# EAGLE design light (EAGLE 7.2.0)
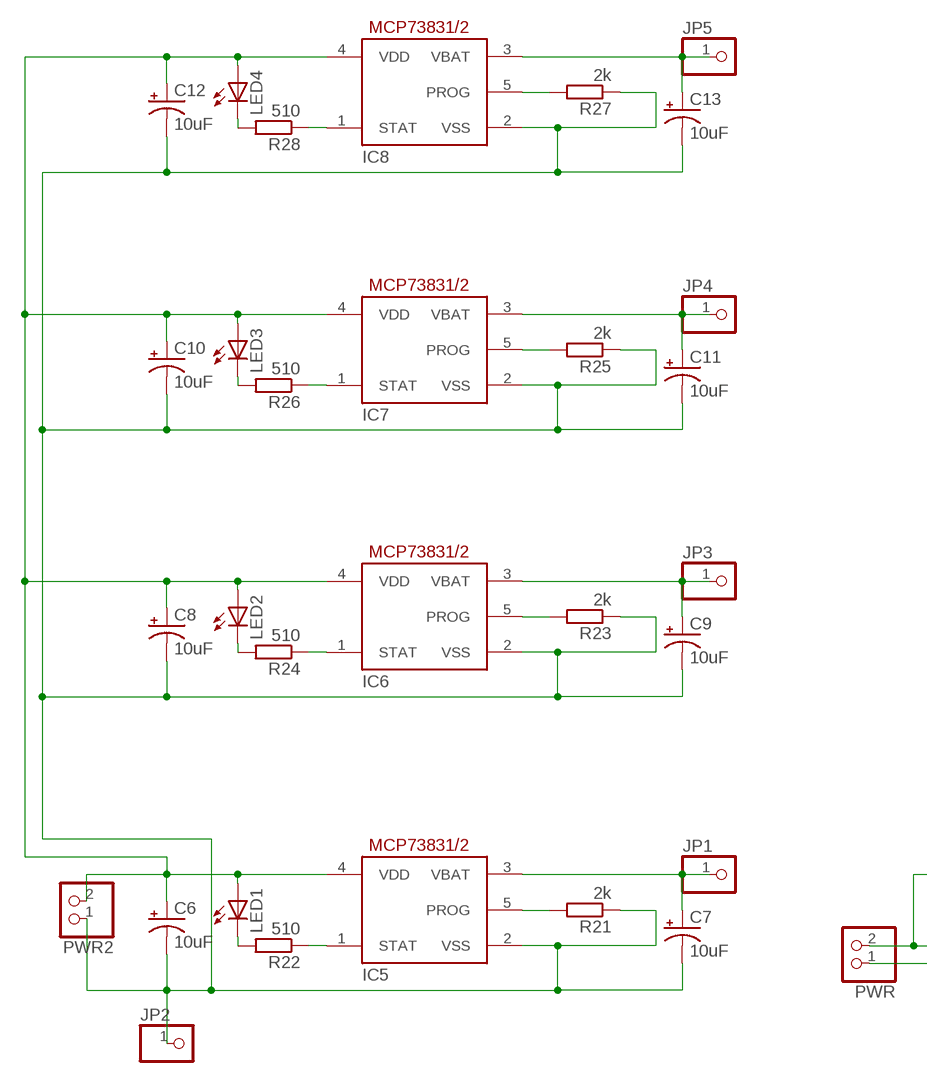
[diagram p0: schematic, sheet 1, part 1 of 2]
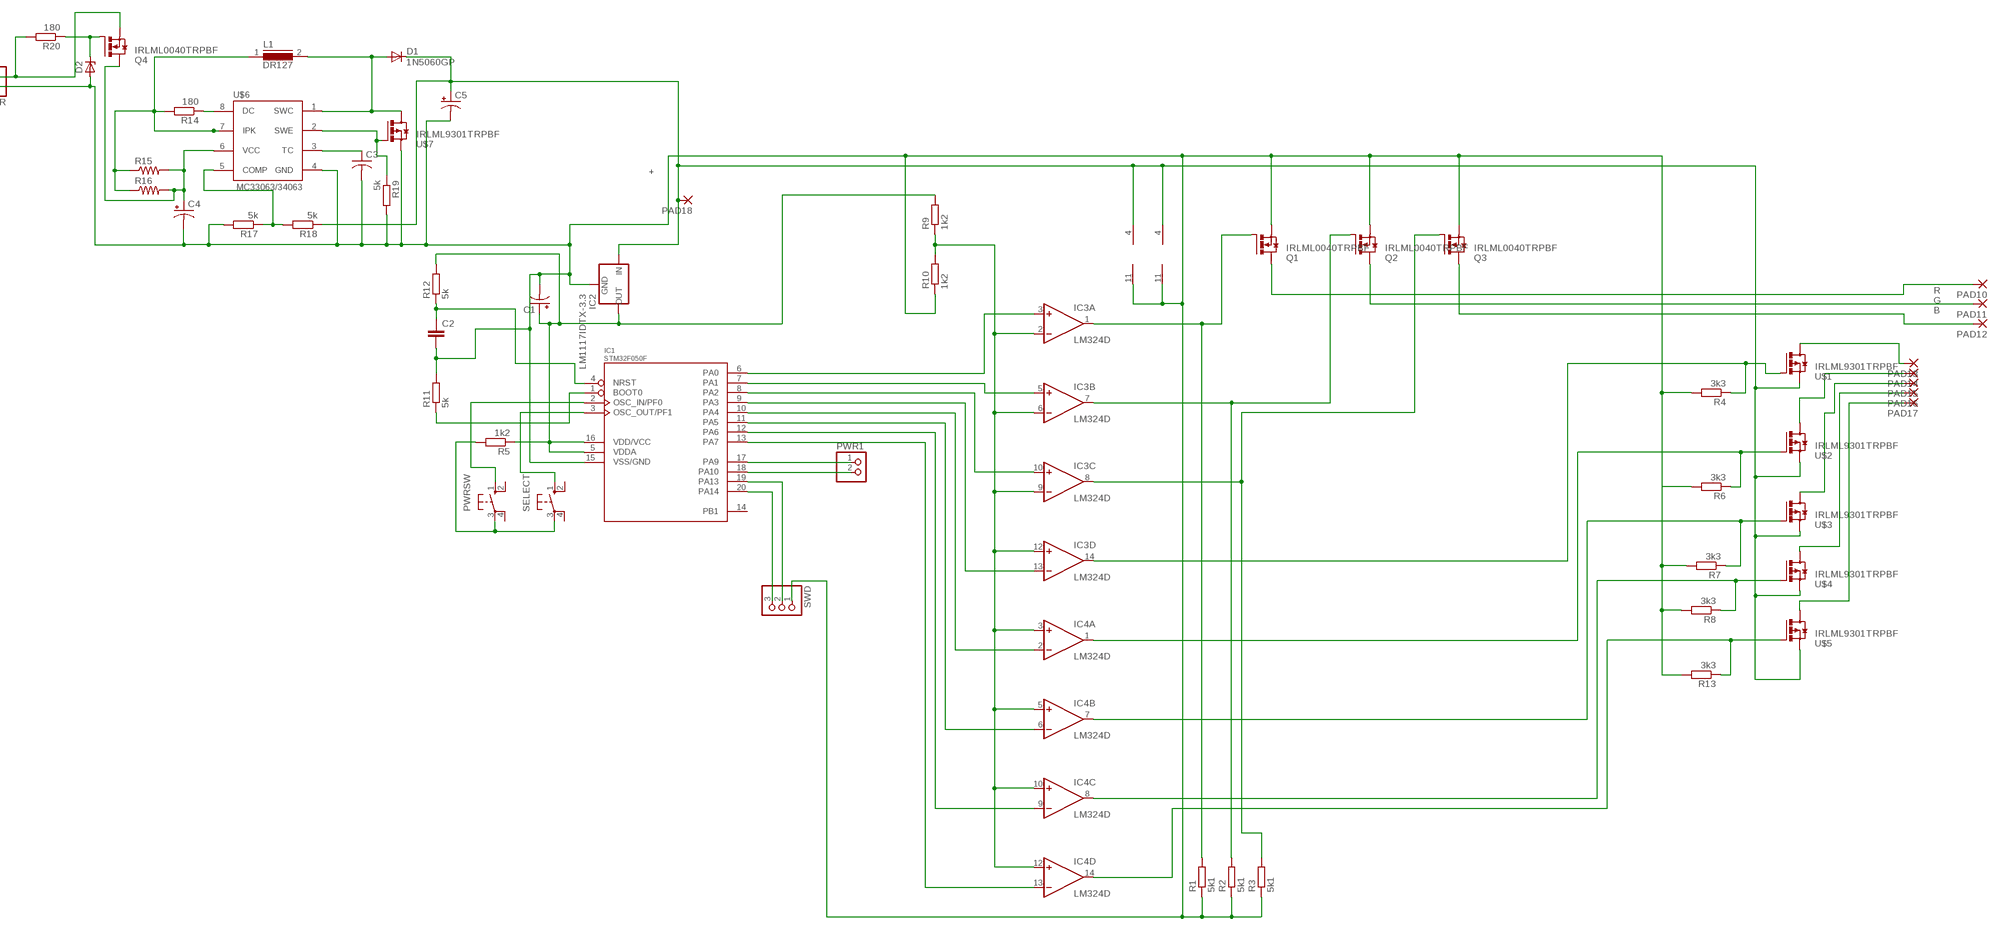
[diagram p1: schematic, sheet 1, part 2 of 2]

## Parts
C1  CPOL-USSMCD  [SMC_D]
C2  C-EUC1206  [C1206]
C3  C-US050-024X044  [C050-024X044]
C4  CPOL-USE5-8.5  [E5-8,5]
C5  CPOL-USE5-8.5  [E5-8,5]
C6  10uF  CPOL-USSMCD  [SMC_D]
C7  10uF  CPOL-USSMCD  [SMC_D]
C8  10uF  CPOL-USSMCD  [SMC_D]
C9  10uF  CPOL-USSMCD  [SMC_D]
C10  10uF  CPOL-USSMCD  [SMC_D]
C11  10uF  CPOL-USSMCD  [SMC_D]
C12  10uF  CPOL-USSMCD  [SMC_D]
C13  10uF  CPOL-USSMCD  [SMC_D]
D1  1N5060GP  [DO15-12]
D2  ZENER-DIODESOD80C  [SOD80C]
IC1  STM32F050F  [TSSOP20]
IC2  LM1117IDTX-3.3  [TO252]
IC3  LM324D  [SO14]
IC4  LM324D  [SO14]
IC5  MCP73831/OT  [SOT23-5L]
IC6  MCP73831/OT  [SOT23-5L]
IC7  MCP73831/OT  [SOT23-5L]
IC8  MCP73831/OT  [SOT23-5L]
JP1  PINHD-1X1  [1X01]
JP2  PINHD-1X1  [1X01]
JP3  PINHD-1X1  [1X01]
JP4  PINHD-1X1  [1X01]
JP5  PINHD-1X1  [1X01]
L1  DR127  [DR127]
LED1  LED  [SMARTLED-TTW]
LED2  LED  [SMARTLED-TTW]
LED3  LED  [SMARTLED-TTW]
LED4  LED  [SMARTLED-TTW]
PAD10  SMD2  [SMD1,27-2,54]
PAD11  SMD2  [SMD1,27-2,54]
PAD12  SMD2  [SMD1,27-2,54]
PAD13  SMD2  [SMD1,27-2,54]
PAD14  SMD2  [SMD1,27-2,54]
PAD15  SMD2  [SMD1,27-2,54]
PAD16  SMD2  [SMD1,27-2,54]
PAD17  SMD2  [SMD1,27-2,54]
PAD18  SMD2  [SMD1,27-2,54]
PWR  PINHD-1X2  [1X02]
PWR1  PINHD-1X2  [1X02]
PWR2  PINHD-1X2  [1X02]
PWRSW  10-XX  [B3F-10XX]
Q1  IRLML0040TRPBF  [MICRO3]
Q2  IRLML0040TRPBF  [MICRO3]
Q3  IRLML0040TRPBF  [MICRO3]
Q4  IRLML0040TRPBF  [MICRO3]
R1  5k1  R-EU_M1206  [M1206]
R2  5k1  R-EU_M1206  [M1206]
R3  5k1  R-EU_M1206  [M1206]
R4  3k3  R-EU_M1206  [M1206]
R5  1k2  R-EU_M1206  [M1206]
R6  3k3  R-EU_M1206  [M1206]
R7  3k3  R-EU_M1206  [M1206]
R8  3k3  R-EU_M1206  [M1206]
R9  1k2  R-EU_M1206  [M1206]
R10  1k2  R-EU_M1206  [M1206]
R11  5k  R-EU_M1206  [M1206]
R12  5k  R-EU_M1206  [M1206]
R13  3k3  R-EU_M1206  [M1206]
R14  180  R-EU_M1206  [M1206]
R15  R-US_0207/12  [0207/12]
R16  R-US_0207/12  [0207/12]
R17  5k  R-EU_M1206  [M1206]
R18  5k  R-EU_M1206  [M1206]
R19  5k  R-EU_M1206  [M1206]
R20  180  R-EU_M1206  [M1206]
R21  2k  R-EU_M1206  [M1206]
R22  510  R-EU_M1206  [M1206]
R23  2k  R-EU_M1206  [M1206]
R24  510  R-EU_M1206  [M1206]
R25  2k  R-EU_M1206  [M1206]
R26  510  R-EU_M1206  [M1206]
R27  2k  R-EU_M1206  [M1206]
R28  510  R-EU_M1206  [M1206]
SELECT  10-XX  [B3F-10XX]
SWD  PINHD-1X3  [1X03]
U$1  IRLML9301TRPBF  [MICRO3]
U$2  IRLML9301TRPBF  [MICRO3]
U$3  IRLML9301TRPBF  [MICRO3]
U$4  IRLML9301TRPBF  [MICRO3]
U$5  IRLML9301TRPBF  [MICRO3]
U$6  MC33063/MC34063D  [SO08]
U$7  IRLML9301TRPBF  [MICRO3]

## Nets
N$1: IC3.8(C:OUT) Q3.1(G) R3.2
N$2: IC3.7(B:OUT) Q2.1(G) R2.2
N$3: IC3.14(D:OUT) R4.1 U$1.1(G)
N$4: IC4.1(A:OUT) R6.1 U$2.1(G)
N$5: PWR.2 Q4.2(S) R20.2
N$6: PWRSW.3(P) R5.2 SELECT.3(P)
N$7: PAD10.1(P) Q1.3(D)
N$8: PAD11.1(P) Q2.3(D)
N$9: PAD12.1(P) Q3.3(D)
N$10: IC4.7(B:OUT) R7.1 U$3.1(G)
N$11: IC4.8(C:OUT) R8.1 U$4.1(G)
N$12: IC4.14(D:OUT) R13.1 U$5.1(G)
N$13: IC1.6(PA0) IC3.3(A:+IN)
N$14: IC1.7(PA1) IC3.5(B:+IN)
N$15: IC1.8(PA2) IC3.10(C:+IN)
N$16: IC1.9(PA3) IC3.13(D:-IN)
N$17: IC1.10(PA4) IC4.2(A:-IN)
N$18: IC1.11(PA5) IC4.6(B:-IN)
N$19: IC1.12(PA6) IC4.9(C:-IN)
N$20: IC1.13(PA7) IC4.13(D:-IN)
N$21: PAD13.1(P) U$1.3(D)
N$22: PAD14.1(P) U$2.3(D)
N$23: PAD15.1(P) U$3.3(D)
N$24: IC3.2(A:-IN) IC3.6(B:-IN) IC3.9(C:-IN) IC3.12(D:+IN) IC4.3(A:+IN) IC4.5(B:+IN) IC4.10(C:+IN) IC4.12(D:+IN) R9.1 R10.2
N$25: PAD16.1(P) U$4.3(D)
N$26: PAD17.1(P) U$5.3(D)
N$27: IC1.17(PA9) PWR1.1
N$28: IC1.18(PA10) PWR1.2
N$30: L1.1 R14.2 R15.1 R16.1 U$6.7(IPK)
N$31: C2.1 IC1.4(NRST) R12.1
N$32: IC1.1(BOOT0) R11.1
N$33: D1.A L1.2 U$6.1(SWC) U$7.3(D)
N$34: IC1.19(PA13) SWD.2
N$35: IC1.20(PA14) SWD.3
N$36: R14.1 U$6.8(DC)
N$37: IC1.2(OSC_IN/PF0) PWRSW.1(S)
N$38: C4.+ Q4.3(D) R15.2 R16.2 U$6.6(VCC)
N$39: IC3.1(A:OUT) Q1.1(G) R1.2
N$40: C1.+ IC1.5(VDDA) IC1.16(VDD/VCC) IC2.TAB(OUT) R5.1 R9.2 R12.2
N$41: C1.- C2.2 C3.2 C4.- C5.- D2.A IC1.15(VSS/GND) IC2.1(GND) IC3.11(P:V-) IC4.11(P:V-) PWR.1 Q1.2(S) Q2.2(S) Q3.2(S) R1.1 R2.1 R3.1 R4.2 R6.2 R7.2 R8.2 R10.1 R11.2 R13.2 R17.2 R19.2 SWD.1 U$6.4(GND) U$7.2(S)
N$42: C3.1 U$6.3(TC)
N$43: C5.+ D1.C IC2.2(IN) IC3.4(P:V+) IC4.4(P:V+) PAD18.1(P) R18.1 U$1.2(S) U$2.2(S) U$3.2(S) U$4.2(S) U$5.2(S)
N$44: D2.C Q4.1(G) R20.1
N$45: IC5.5(PROG) R21.2
N$46: IC1.3(OSC_OUT/PF1) SELECT.1(S)
N$47: R17.1 R18.2 U$6.5(COMP)
N$49: R19.1 U$6.2(SWE) U$7.1(G)
N$50: IC5.1(STAT) R22.1
N$52: LED1.C@1(C) R22.2
N$53: IC6.5(PROG) R23.2
N$54: C7.+ IC5.3(VBAT) JP1.1
N$55: C6.- C7.- C8.- C9.- C10.- C11.- C12.- C13.- IC5.2(VSS) IC6.2(VSS) IC7.2(VSS) IC8.2(VSS) JP2.1 PWR2.1 R21.1 R23.1 R25.1 R27.1
N$56: IC6.1(STAT) R24.1
N$57: C6.+ C8.+ C10.+ C12.+ IC5.4(VDD) IC6.4(VDD) IC7.4(VDD) IC8.4(VDD) LED1.A@1(A) LED2.A@1(A) LED3.A@1(A) LED4.A@1(A) PWR2.2
N$58: LED2.C@1(C) R24.2
N$59: C9.+ IC6.3(VBAT) JP3.1
N$60: IC7.5(PROG) R25.2
N$62: IC7.1(STAT) R26.1
N$64: LED3.C@1(C) R26.2
N$65: C11.+ IC7.3(VBAT) JP4.1
N$66: IC8.5(PROG) R27.2
N$68: IC8.1(STAT) R28.1
N$70: LED4.C@1(C) R28.2
N$71: C13.+ IC8.3(VBAT) JP5.1
Unconnected: IC1.14(PB1) PWRSW.2(S1) PWRSW.4(P1) SELECT.2(S1) SELECT.4(P1)

## Notes on the sheet
- +
- R
- G
- B

## Library data of the parts
C1 C6-C13 = rcl:CPOL-US: POLARIZED CAPACITOR, American symbol
C2 = rcl:C-EU: CAPACITOR, European symbol
C3 = adafruit:C-US: CAPACITOR, American symbol
C4 C5 = adafruit:CPOL-US: POLARIZED CAPACITOR, American symbol
D1 = diode:1N5060GP: DIODE controlled avalanche rectifier
D2 = diode:ZENER-DIODE: Z-Diode
IC1 = STM32F050:STM32F050*: STM32F050xxF*
IC2 = lm1117:LM1117IDTX-*
IC3 IC4 = linear:LM324: OP AMP
IC5-IC8 = adafruit:MCP73831: MCP73831/2 Miniature Single-Cell, Fully Integrated Li-Ion, Li-Polymer Charge Management Controllers. Nice and small simple lipoly charge controller, with adjustable current and status output (LED) http://www.ladyada.net/library/pcb/eaglelibrary.html
JP1-JP5 = adafruit:PINHD-1X1: Pin header 1x1 for 0.1" spacing With round pins
L1 = inductors:DR127: High Power Density, High Efficiency, Shielded Inductors Source: coiltronics_dr_series.pdf
LED1-LED4 = adafruit:LED: LED OSRAM: - CHIPLED LG R971, LG N971, LY N971, LG Q971, LY Q971, LO R971, LY R971 LH N974, LH R974 LS Q976, LO Q976, LY Q976 LO Q996 - Hyper CHIPLED LW Q18S LB Q993, LB Q99A, LB R99A - SideLED LS A670, LO A670, LY A670, LG A670, LP A670 LB A673, LV A673, LT A673, LW A673 LH A674 LY A675 LS A676, LA A676, LO A676, LY A676, LW A676 LS A679, LY A679, LG A679 - Hyper Micro SIDELED® LS Y876, LA Y876, LO Y876, LY Y876 LT Y87S - SmartLED LW L88C, LW L88S LB L89C, LB L89S, LG L890 LS L89K, LO L89K, LY L89K LS L896, LA L896, LO L896, LY L896 - TOPLED LS T670, LO T670, LY T670, LG T670, LP T670 LSG T670, LSP T670, LSY T670, LOP T670, LYG T670 LG T671, LOG T671, LSG T671 LB T673, LV T673, LT T673, LW T673 LH T674 LS T676, LA T676, LO T676, LY T676, LB T676, LH T676, LSB T676, LW T676 LB T67C, LV T67C, LT T67C, LS T67K, LO T67K, LY T67K, LW E67C LS E67B, LA E67B, LO E67B, LY E67B, LB E67C, LV E67C, LT E67C LW T67C LS T679, LY T679, LG T679 LS T770, LO T770, LY T770, LG T770, LP T770 LB T773, LV T773, LT T773, LW T773 LH T774 LS E675, LA E675, LY E675, LS T675 LS T776, LA T776, LO T776, LY T776, LB T776 LHGB T686 LT T68C, LB T68C - Hyper Mini TOPLED® LB M676 - Mini TOPLED Santana® LG M470 LS M47K, LO M47K, LY M47K Source: http://www.osram.convergy.de/
PAD10-PAD18 = wirepad:SMD2: SMD PAD
PWR PWR1 PWR2 = pinhead:PINHD-1X2: PIN HEADER
PWRSW SELECT = switch-omron:10-XX: OMRON SWITCH; MPN: B3F-1000; OC_FARNELL: 176432; OC_NEWARK: 36M3542
Q1-Q4 = transistor-power:IRLML0040TRPBF: IRLML0040TRPbF NPN MOSFET 40 V 3.6 A
R1-R14 R17-R28 = resistor:R-EU_: RESISTOR, European symbol
R15 R16 = adafruit:R-US_: RESISTOR, American symbol
SWD = adafruit:PINHD-1X3: PIN HEADER
U$1-U$5 U$7 = transistor-power:IRLML9301TRPBF: IRLML9301TRPbF P-MOSFET -30 V -3.6 A
U$6 = adafruit:MC33063/MC34063: MC33063 and MC34063 Basic DC/DC converter with internal power-NPN transistor, 100KHz, 1.5A peak switch current. 3-40 input/output.

## Board
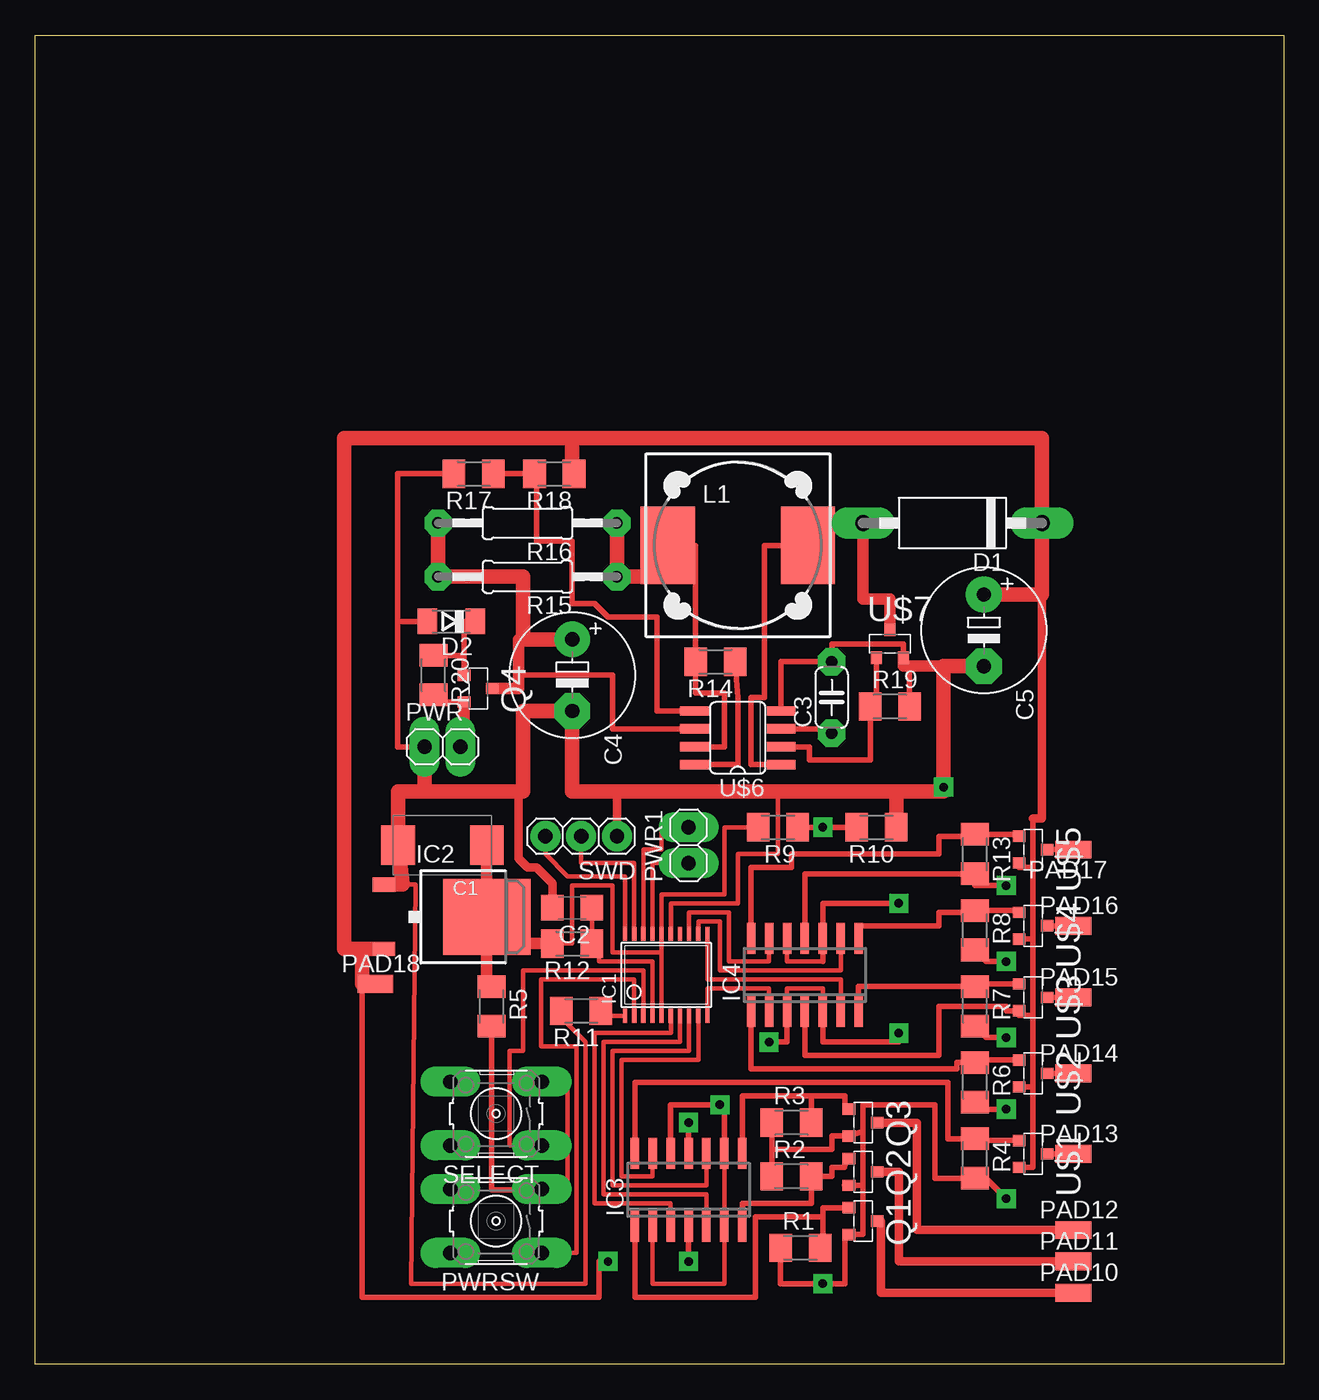
[diagram p2: board, top side]
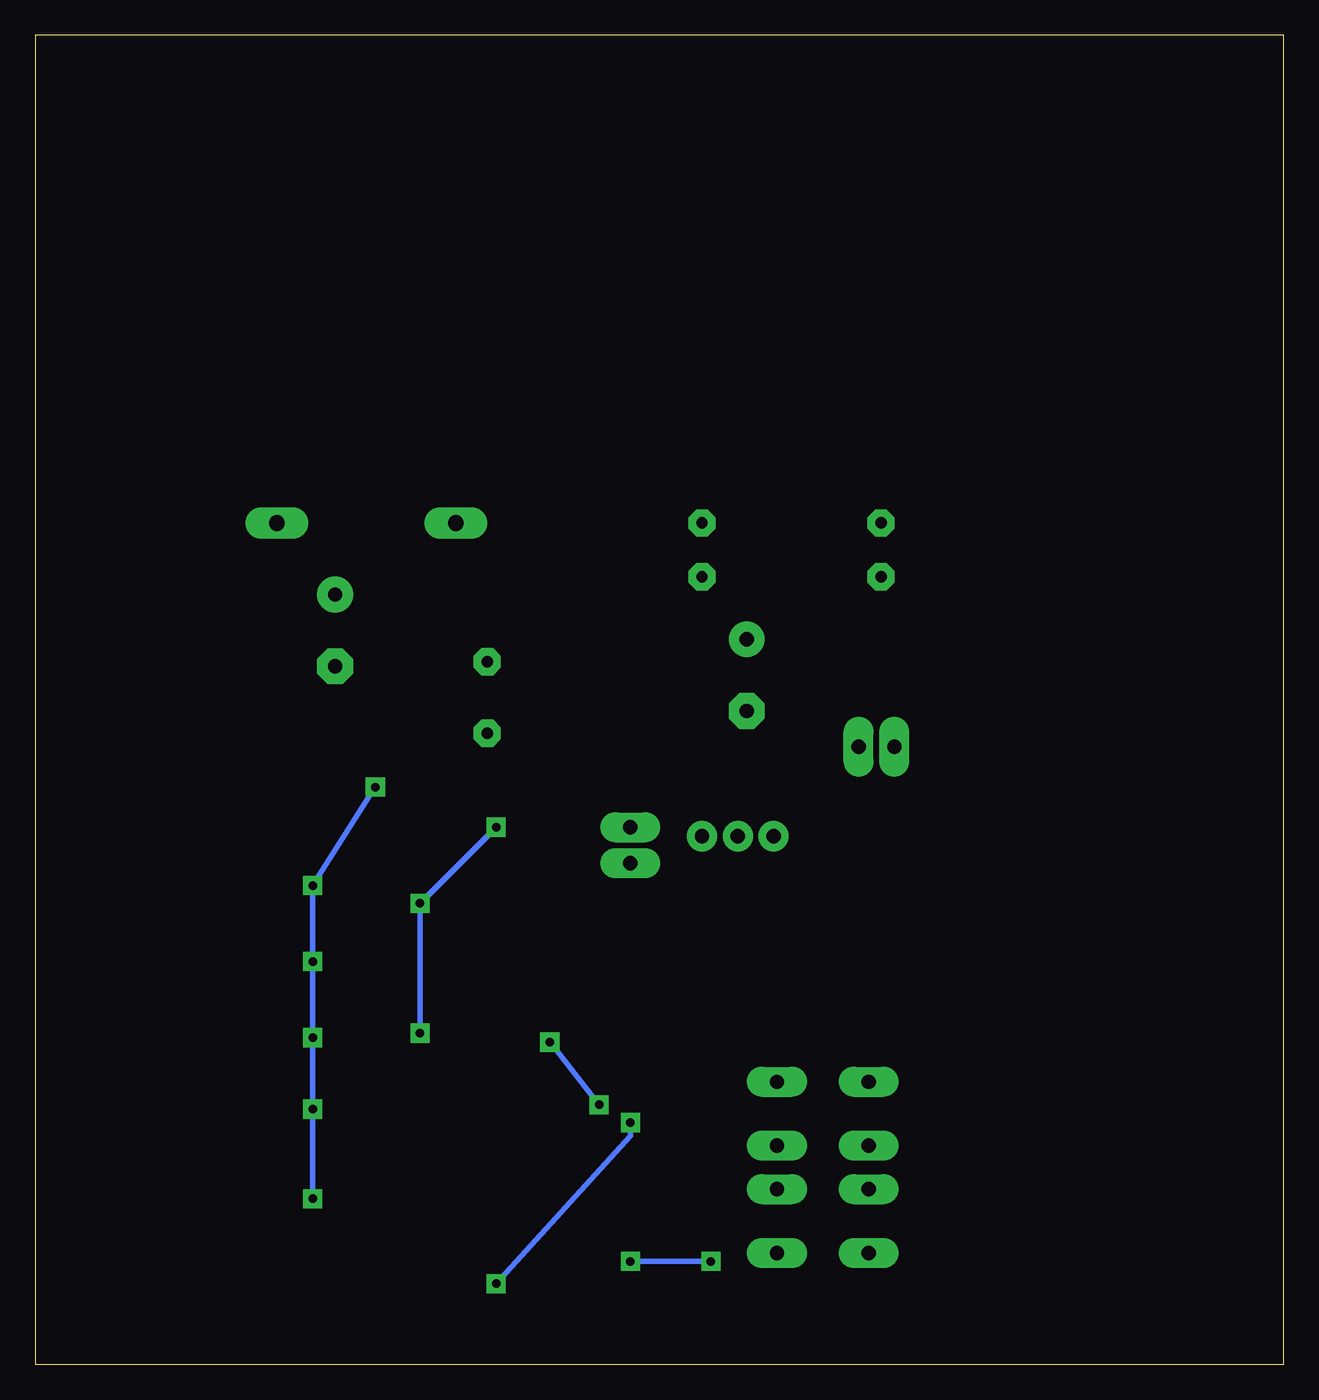
[diagram p3: board, bottom side, seen from below]

Size 88.58 x 94.3 mm. Coordinates in mm from the lower left corner, seen from the top.
Outline: 0,0 0,94.3 88.58,94.3 88.58,0 0,0
Copper layers (1*16): Top 0.035mm / dielectric 1.5mm / Bottom 0.035mm
Design rules "default *": minimum track width 10mil, minimum drill 24mil, track to track 8mil, track to pad 8mil, pad to pad 8mil, via to via 8mil, smd to smd 8mil, copper to edge 40mil, drill to drill 8mil, minimum pad ring 22mil, minimum via ring 15mil, stop-mask expansion 4mil, vias tented up to drill 0mil, thermal gap 10mil

### Footprints (pad centres in the part's own frame; a part is rotated, then mirrored left to right if it is on the bottom)
SMC_D = smd 2.4 x 2.8: + -3.15,0; - 3.15,0
C1206 = smd 1.6 x 1.8: 1 -1.4,0; 2 1.4,0
C050-024X044 = drill 0.813 octagon: 1 -2.54,0; 2 2.54,0
E5-8,5 = drill 1.016 pad 2.54: + -2.54,0 | drill 1.016 pad 2.54 octagon: - 2.54,0
DO15-12 = drill 1.118 long: A 6.35,0; C -6.35,0
SOD80C = smd 1.4 x 1.8: A 1.7,0; C -1.7,0
TSSOP20 = smd 0.305 x 0.991: 1 -2.925,-2.918; 2 -2.275,-2.918; 3 -1.625,-2.918; 4 -0.975,-2.918; 5 -0.325,-2.918; 6 0.325,-2.918; 7 0.975,-2.918; 8 1.625,-2.918; 9 2.275,-2.918; 10 2.925,-2.918; 11 2.925,2.918; 12 2.275,2.918; 13 1.625,2.918; 14 0.975,2.918; 15 0.325,2.918; 16 -0.325,2.918; 17 -0.975,2.918; 18 -1.625,2.918; 19 -2.275,2.918; 20 -2.925,2.918
TO252 = smd 1 x 1.6: 1 -2.28,-4.8; 2 2.28,-4.8 | smd 5.4 x 6.2: TAB 0,2.5
SO14 = smd 0.6 x 2.2: 1 -3.81,-2.6; 2 -2.54,-2.6; 3 -1.27,-2.6; 4 0,-2.6; 5 1.27,-2.6; 6 2.54,-2.6; 7 3.81,-2.6; 8 3.81,2.6; 9 2.54,2.6; 10 1.27,2.6; 11 0,2.6; 12 -1.27,2.6; 13 -2.54,2.6; 14 -3.81,2.6
SOT23-5L = smd 0.55 x 1.2: 1 -0.95,-1.3; 2 0,-1.3; 3 0.95,-1.3; 4 0.95,1.3; 5 -0.95,1.3
1X01 = drill 1.016 pad 1.93 octagon: 1 0,0
DR127 = smd 3.85 x 5.5: 1 -4.975,0; 2 4.975,0
SMARTLED-TTW = smd 0.8 x 0.5: A 0,-0.875; C 0,0.875 | smd 0.35 x 0.35: A@1 0,-0.5; C@1 0,0.5
SMD1,27-2,54 = smd 1.27 x 2.54: 1 0,0
1X02 = drill 1.016 long: 1 -1.27,0; 2 1.27,0
B3F-10XX = drill 1.016 long: 1 -3.251,2.261; 2 3.251,2.261; 3 -3.251,-2.261; 4 3.251,-2.261
MICRO3 = smd 0.8 x 0.9: 1 -0.95,-1; 2 0.95,-1; 3 0,1
M1206 = smd 1.6 x 2: 1 -1.4,0; 2 1.4,0
0207/12 = drill 0.813 pad 1.676 octagon: 1 -6.35,0; 2 6.35,0
1X03 = drill 1.016: 1 -2.54,0; 2 0,0; 3 2.54,0
SO08 = smd 0.66 x 2.032: 1 -1.905,-3.073; 2 -0.635,-3.073; 3 0.635,-3.073; 4 1.905,-3.073; 5 1.905,3.073; 6 0.635,3.073; 7 -0.635,3.073; 8 -1.905,3.073

### Placement (x,y rotation side)
C1  28.89,36.83 180 top
C2  38.1,32.38 180 top
C3  56.52,47.31 90 top
C4  38.1,48.9 270 top
C5  67.31,52.07 270 top
C6  -9.53,-153.03 0 top  (outside the outline)
C7  -9.53,-159.38 0 top  (outside the outline)
C8  -9.53,-167.64 0 top  (outside the outline)
C9  -0.32,-167.64 0 top  (outside the outline)
C10  -9.53,-189.55 0 top  (outside the outline)
C11  -0.32,-189.55 0 top  (outside the outline)
C12  -9.53,-211.46 0 top  (outside the outline)
C13  -0.32,-211.46 0 top  (outside the outline)
D1  65.09,59.69 180 top
D2  29.53,52.7 180 top
IC1  44.77,27.62 0 top
IC2  29.53,31.75 270 top
IC3  46.35,12.38 0 top
IC4  54.61,27.62 0 top
IC5  -6.35,-117.79 0 top  (outside the outline)
IC6  -11.43,-175.58 0 top  (outside the outline)
IC7  -11.43,-197.49 0 top  (outside the outline)
IC8  -11.43,-219.39 0 top  (outside the outline)
JP1  -12.06,-142.56 0 top  (outside the outline)
JP2  -12.06,-147.64 0 top  (outside the outline)
JP3  -3.17,-183.2 0 top  (outside the outline)
JP4  -3.17,-205.1 0 top  (outside the outline)
JP5  -3.17,-227.01 0 top  (outside the outline)
L1  49.85,58.1 0 top
LED1  -11.75,-132.08 0 top  (outside the outline)
LED2  -6.35,-183.51 0 top  (outside the outline)
LED3  -6.35,-205.42 0 top  (outside the outline)
LED4  -6.35,-227.33 0 top  (outside the outline)
PAD10  73.66,5.08 270 top
PAD11  73.66,7.3 270 top
PAD12  73.66,9.53 270 top
PAD13  73.66,14.92 270 top
PAD14  73.66,20.64 270 top
PAD15  73.66,26.04 270 top
PAD16  73.66,31.11 270 top
PAD17  73.66,36.51 90 top
PAD18  24.13,26.99 270 top
PWR  28.89,43.81 0 top
PWR1  46.35,36.83 90 top
PWR2  -10.79,-137.48 0 top  (outside the outline)
PWRSW  32.7,10.16 180 top
Q1  58.74,10.16 270 top
Q2  58.74,13.65 270 top
Q3  58.74,17.14 270 top
Q4  31.43,47.94 270 top
R1  54.29,8.26 0 top
R2  53.66,13.34 0 top
R3  53.66,17.14 0 top
R4  66.67,14.61 270 top
R5  32.38,25.4 270 top
R6  66.67,20 270 top
R7  66.67,25.4 270 top
R8  66.67,30.8 270 top
R9  52.7,38.1 180 top
R10  59.69,38.1 180 top
R11  38.73,25.08 180 top
R12  38.1,29.84 180 top
R13  66.67,36.2 270 top
R14  48.26,49.85 180 top
R15  34.92,55.88 180 top
R16  34.92,59.69 180 top
R17  31.11,63.18 180 top
R18  36.83,63.18 180 top
R19  60.64,46.67 0 top
R20  28.26,48.9 270 top
R21  -6.35,-124.78 0 top  (outside the outline)
R22  -6.35,-130.81 0 top  (outside the outline)
R23  1.91,-174.94 0 top  (outside the outline)
R24  -11.43,-182.56 0 top  (outside the outline)
R25  1.91,-196.85 0 top  (outside the outline)
R26  -11.43,-204.47 0 top  (outside the outline)
R27  1.91,-218.76 0 top  (outside the outline)
R28  -11.43,-226.38 0 top  (outside the outline)
SELECT  32.7,17.78 180 top
SWD  38.73,37.47 180 top
U$1  70.8,14.92 270 top
U$2  70.8,20.64 270 top
U$3  70.8,26.04 270 top
U$4  70.8,31.11 270 top
U$5  70.8,36.51 270 top
U$6  49.85,44.45 90 top
U$7  60.64,51.12 0 top

### Tracks (layer width: path | path; a pad name or v marks a point on that pad's centre or on a via)
N$1
  Top 0.406: IC3.8 50.16,19.05 55.06,19.05 | 55.06,19.05 57.47,19.05 57.47,18.09 Q3.1 | R3.2 55.06,19.05
N$2
  Top 0.406: Q2.1 57.42,13.97 56.52,13.97 56.52,13.34 R2.2 55.06,11.43 50.16,11.43 IC3.7
N$3
  Top 0.406: IC3.14 42.55,20 64.77,20 64.77,16 R4.1 66.67,15.87 U$1.1
N$4
  Top 0.406: U$2.1 66.67,21.59 R6.1 65.41,21.4 65.41,20.95 50.8,20.95 IC4.1
N$5
  Top 0.406: Q4.2 28.26,46.99 R20.2
  Top 0.813: PWR.2 30.43,43.81 Q4.2
N$6
  Top 0.305: SELECT.3 37.78,20.04 37.78,12.38 35.64,12.38 PWRSW.3
  Top 0.406: R5.2 32.38,12.38 35.95,12.38 PWRSW.3
N$7
  Top 0.61: Q1.3 60.01,10.16 60.01,5.08 PAD10.1
N$8
  Top 0.61: Q2.3 61.28,13.65 61.28,7.3 PAD11.1
N$9
  Top 0.61: Q3.3 62.55,17.14 62.55,9.53 PAD12.1
N$10
  Top 0.406: U$3.1 66.67,26.98 R7.1 58.42,26.8 IC4.7
N$11
  Top 0.406: IC4.8 58.42,31.11 64.14,31.11 64.14,32.06 66.67,32.06 R8.1 69.8,32.2 U$4.1
N$12
  Top 0.406: IC4.14 50.8,35.24 53.66,35.24 53.66,36.2 64.14,36.2 64.14,37.47 66.67,37.47 R13.1 69.8,37.59 U$5.1
N$13
  Top 0.305: IC3.3 45.09,11.43 39.69,11.43 39.69,23.5 45.09,23.5 IC1.6
N$14
  Top 0.305: IC3.5 47.62,12.06 40.32,12.06 40.32,22.86 45.74,22.86 IC1.7
N$15
  Top 0.305: IC3.10 47.62,12.7 40.96,12.7 40.96,22.23 46.39,22.23 IC1.8
N$16
  Top 0.305: IC3.13 43.81,13.34 41.59,13.34 41.59,21.59 47.04,21.59 IC1.9
N$17
  Top 0.305: IC1.10 47.69,26.67 52.07,26.67 IC4.2
N$18
  Top 0.305: IC4.6 57.15,27.3 47.69,27.3 IC1.11
N$19
  Top 0.305: IC4.9 57.15,27.94 48.58,27.94 48.58,31.43 47.04,31.43 IC1.12
N$20
  Top 0.305: IC4.13 52.07,28.57 49.21,28.57 49.21,32.07 46.39,32.07 IC1.13
N$21
  Top 0.406: U$1.3 PAD13.1
N$22
  Top 0.406: U$2.3 PAD14.1
N$23
  Top 0.406: U$3.3 PAD15.1
N$24  (via drill 0.6)
  Top 0.305: IC4.3 53.34,26.67 55.88,26.67 IC4.5 | IC4.10 55.88,28.57 53.34,28.57 IC4.12 | IC3.2 43.81,5.71 48.9,5.71 IC3.6 IC3.9
  Top 0.406: IC3.9 48.9,17.78 v48.58,18.41 45.09,18.41 IC3.12 | 55.88,28.57 55.88,32.7 v61.28,32.7 | v61.28,23.5 61.28,22.86 55.88,22.86 IC4.5 | IC4.3 53.34,22.86 v52.07,22.86 | R10.2 v55.88,38.1 R9.1
  Bottom 0.406: v48.58,18.41 v52.07,22.86 | v61.28,23.5 v61.28,32.7 v55.88,38.1
N$25
  Top 0.406: U$4.3 PAD16.1
N$26
  Top 0.406: U$5.3 PAD17.1
N$27
  Top 0.305: IC1.17 43.79,35.56 PWR1.1
N$28
  Top 0.305: IC1.18 43.14,36.51 44.45,36.51 44.45,38.1 PWR1.2
N$30
  Top 0.406: U$6.7 48.9,43.81 48.9,47.62 46.86,47.62 R14.2 46.86,58.1 L1.1
  Top 1.016: R16.1 R15.1 44.87,55.88 L1.1
N$31
  Top 0.305: IC1.4 43.79,28.57 40.01,28.57 40.01,29.84 R12.1 C2.1
N$32
  Top 0.305: R11.1 40.45,24.7 IC1.1
N$33
  Top 0.406: U$6.1 50.8,42.55 50.8,47.31 51.75,47.31 51.75,58.1 L1.2
  Top 0.813: L1.2 54.82,59.69 D1.A 58.74,54.29 60.64,54.29 U$7.3
N$34
  Top 0.305: IC1.19 42.49,35.56 38.73,35.56 SWD.2
N$35
  Top 0.305: IC1.20 41.84,34.61 37.78,34.61 36.2,36.2 SWD.3
N$36
  Top 0.406: R14.1 49.85,47.31 49.85,42.55 U$6.8
N$37
  Top 0.305: IC1.2 42.49,27.3 35.88,27.3 35.88,22.54 38.42,22.54 38.42,7.9 PWRSW.1
N$38
  Top 0.406: 34.29,48.9 40.96,48.9 40.96,45.09 U$6.6
  Top 0.813: 34.61,51.44 34.29,51.44 34.29,48.9 34.29,47.94 Q4.3
  Top 1.016: C4.+ 34.61,51.44 34.61,55.88 R15.2 R16.2
N$39
  Top 0.406: IC3.1 42.55,4.76 51.12,4.76 51.12,10.48 55.88,10.48 | 55.88,10.48 55.88,11.11 Q1.1 | 55.88,10.48 55.88,8.26 R1.2
N$40
  Top 0.305: 44.44,29.21 IC1.16 44.44,33.34 48.9,33.34 48.89,38.1 R9.2 | 44.44,29.21 IC1.5 | R12.2 38.1,29.84 38.1,33.97 40.96,33.97 40.96,29.21 44.44,29.21
  Top 0.813: IC2.TAB 32.03,29.84 R12.2 | IC2.TAB 32.03,26.8 R5.1 | IC2.TAB 32.03,37.47 C1.+
N$41  (via drill 0.6)
  Top 0.305: IC1.15 45.09,32.7 49.85,32.7 49.85,36.2 52.7,36.2 52.7,40.64 53.02,40.64 | R11.2 37.34,24.58 39.05,22.86 39.05,5.71 26.67,5.71 26.99,34.03 26.06,34.03
  Top 0.406: D2.A 25.72,52.7 | 25.72,52.7 25.72,43.81 PWR.1 | U$6.4 52.92,49.85 C3.2 56.52,51.12 61.59,51.12 U$7.2 | R19.2 62.04,49.53 61.91,49.53 | R17.2 25.72,63.18 25.72,52.7 | R1.1 52.89,5.71 v55.88,5.71 57.47,5.71 57.47,9.21 Q1.2 58.74,9.21 58.74,12.7 | 58.74,12.7 57.42,12.7 Q2.2 | 58.74,16.51 Q3.2 56.52,16.2 56.52,15.24 52.26,15.24 | 58.74,16.51 58.74,12.7 | 52.26,15.24 R3.1 | IC3.11 v46.35,17.14 | 58.74,16.51 58.74,18.41 63.82,18.41 63.82,13.21 R4.2 67.44,13.21 v68.9,11.75 | IC4.11 54.61,34.8 R13.2 66.67,33.97 v68.9,33.97 | R2.1 52.26,15.24 | v64.45,40.96 63.82,40.64 | R8.2 67.5,28.57 v68.9,28.57 | R7.2 67.5,23.18 v68.9,23.18 | R6.2 67.18,18.1 v68.9,18.1
  Top 0.61: SWD.1 41.27,40.64 | C2.2 36.7,34.1 35.56,35.24 34.92,35.24 34.29,35.88 34.29,40.32 34.61,40.64
  Top 0.813: U$7.2 61.59,49.53 61.91,49.53 64.45,49.53
  Top 1.016: 27.62,40.64 34.61,40.64 34.61,46.35 C4.- 38.1,40.64 41.27,40.64 53.02,40.64 61.09,40.64 | 27.62,40.64 PWR.1 | C5.- 64.45,49.53 v64.45,40.96 64.45,40.64 63.82,40.64 61.09,40.64 | 27.62,40.64 25.74,40.64 C1.- 26.06,34.03 IC2.1 | 61.09,40.64 R10.1
  Bottom 0.406: v46.35,17.14 46.35,16.19 v55.88,5.71 | v64.45,40.96 v68.9,33.97 v68.9,28.57 v68.9,23.18 v68.9,18.1 v68.9,11.75
N$42
  Top 0.406: C3.1 56.52,45.09 U$6.3
N$43  (via drill 0.6)
  Top 0.406: 70.8,38.73 70.8,35.24 | 70.8,35.24 70.8,30.16 | 70.8,30.16 70.8,24.77 | 70.8,24.77 70.8,19.68 | 70.8,19.68 70.8,13.97 U$1.2 | U$2.2 70.8,19.68 | 70.8,24.77 69.8,24.77 U$3.2 68.9,25.09 68.9,25.4 64.14,25.4 64.14,21.91 54.61,21.91 IC4.4 | U$4.2 70.8,30.16 | U$5.2 69.8,35.24 70.8,35.24 | IC3.4 v46.35,7.3 | v40.64,7.3 40.01,7.3 40.01,4.76 23.18,4.76 23.18,26.99
  Top 0.61: 71.44,54.61 71.44,38.73 70.8,38.73
  Top 1.016: C5.+ 71.44,54.61 D1.C 71.44,65.72 38.1,65.72 | 38.1,65.72 21.91,65.72 21.91,29.47 23.18,29.47 | 23.18,29.47 IC2.2 | PAD18.1 23.18,26.99 23.18,29.47 | R18.1 38.1,63.18 38.1,65.72
  Bottom 0.406: v46.35,7.3 v40.64,7.3
N$44
  Top 0.406: R20.1 30.43,50.3 | 30.43,50.3 Q4.1 | D2.C 30.43,52.7 30.43,50.3
N$45  (1 unrouted)
N$46
  Top 0.305: IC1.3 43.14,27.94 34.61,27.94 34.61,22.23 33.66,22.23 33.66,15.52 SELECT.1
N$47
  Top 0.406: 46.77,46.48 U$6.5 44.13,46.35 44.13,53.02 40.64,53.02 39.69,53.98 38.1,53.98 38.1,58.42 35.56,58.42 35.56,63.18 R18.2 R17.1
N$49
  Top 0.406: U$7.1 59.69,46.67 R19.1 59.24,42.86 54.93,42.86 54.93,43.81 U$6.2
N$50  (1 unrouted)
N$52  (1 unrouted)
N$53  (1 unrouted)
N$54  (2 unrouted)
N$55  (17 unrouted)
N$56  (1 unrouted)
N$57  (12 unrouted)
N$58  (1 unrouted)
N$59  (2 unrouted)
N$60  (1 unrouted)
N$62  (1 unrouted)
N$64  (1 unrouted)
N$65  (2 unrouted)
N$66  (1 unrouted)
N$68  (1 unrouted)
N$70  (1 unrouted)
N$71  (2 unrouted)